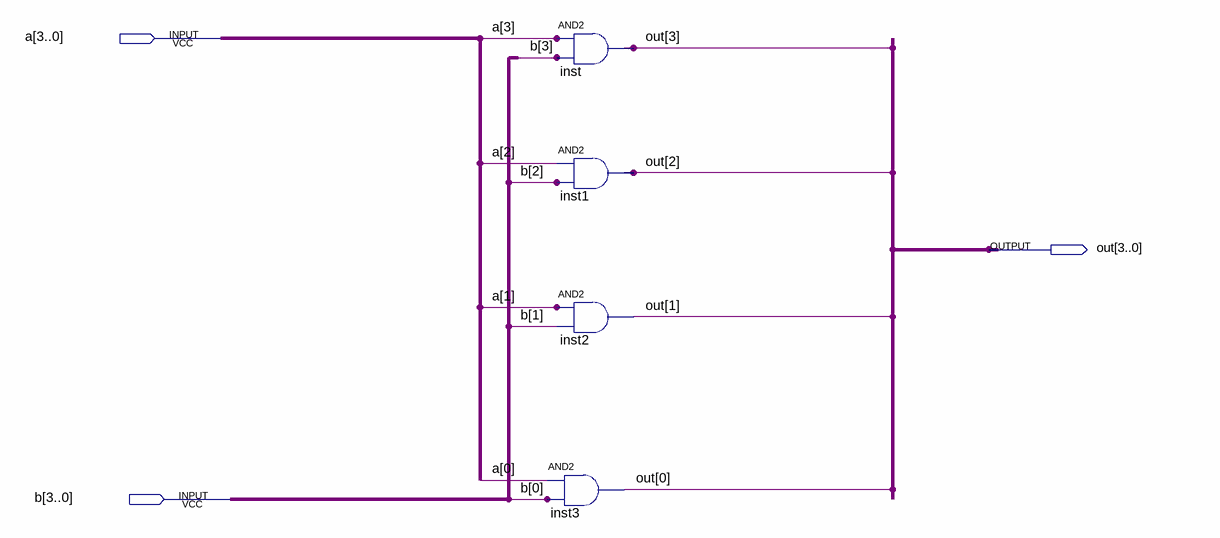
[diagram p0: schematic sheet]
// Quartus schematic fourbitwiseAnd.bdf as structural Verilog: 4 symbols, 3 pins
module fourbitwiseAnd (
  input  [3:0] a,
  input  [3:0] b,
  output [3:0] out
);

  and inst3 (out[0], a[0], b[0]);
  and inst (out[3], a[3], b[3]);
  and inst1 (out[2], a[2], b[2]);
  and inst2 (out[1], a[1], b[1]);
endmodule
